# EAGLE design 20pin-adapter (EAGLE 7.4.0)
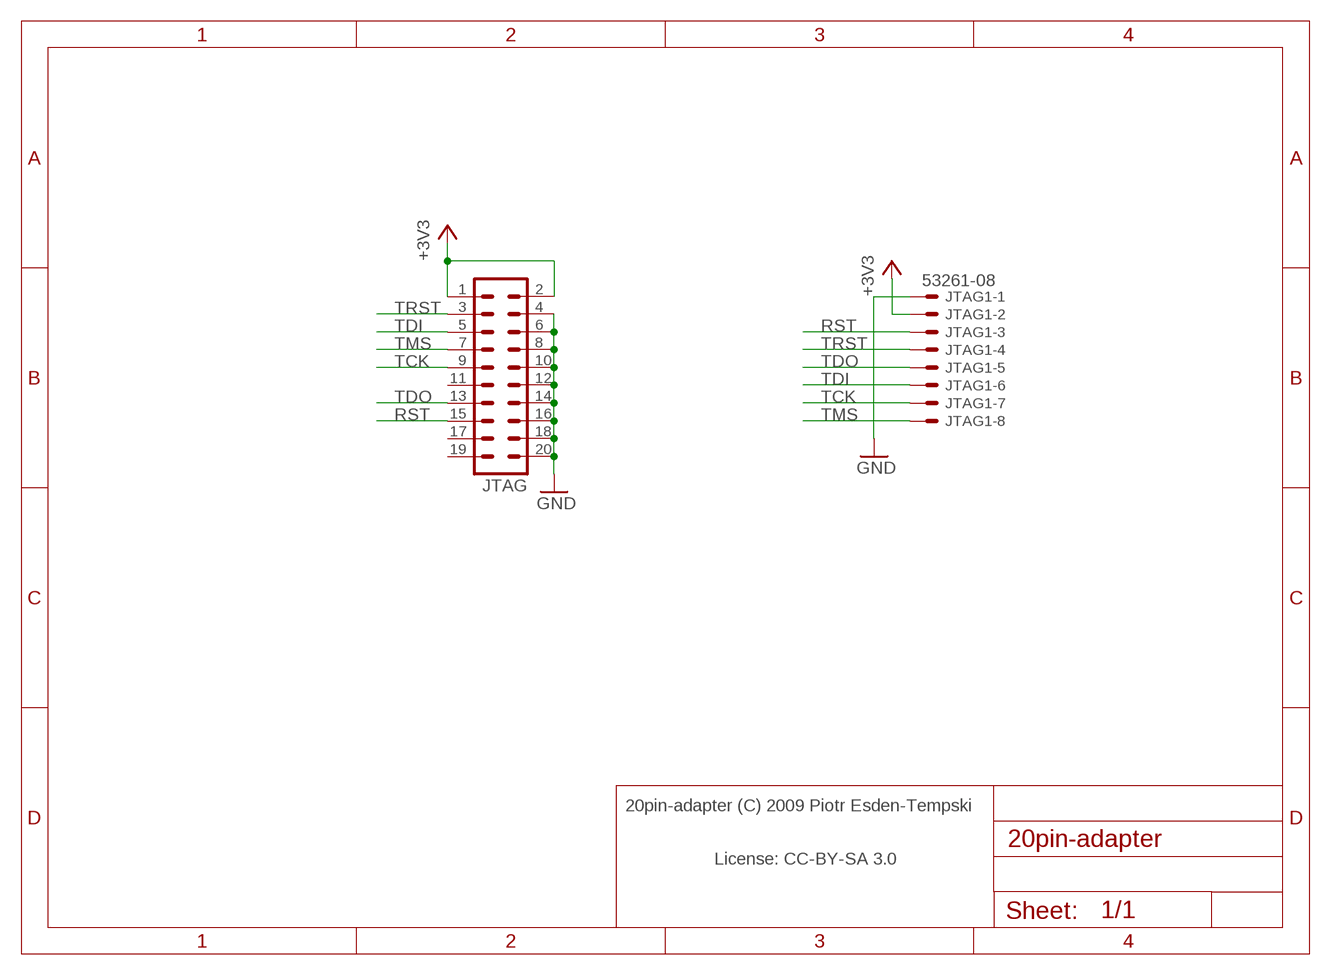
[diagram p0: schematic, sheet 1]

## Parts
JTAG  MA10-2  [MA10-2]
JTAG1  53261-08  [53261-08]

## Nets
+3V3: JTAG1.2 JTAG.1 JTAG.2
GND: JTAG1.1 JTAG.4 JTAG.6 JTAG.8 JTAG.10 JTAG.12 JTAG.14 JTAG.16 JTAG.18 JTAG.20
RST: JTAG1.3 JTAG.15
TCK: JTAG1.7 JTAG.9
TDI: JTAG1.6 JTAG.5
TDO: JTAG1.5 JTAG.13
TMS: JTAG1.8 JTAG.7
TRST: JTAG1.4 JTAG.3
Unconnected: JTAG.11 JTAG.17 JTAG.19

## Notes on the sheet
- 20pin-adapter (C) 2009 Piotr Esden-Tempski
- License: CC-BY-SA 3.0

## Library data of the parts
JTAG = con-lstb:MA10-2: PIN HEADER
JTAG1 = con-molex:53?-08: CONNECTOR wire to board 1.25 mm (.049 inch) pitch header

## Net classes
0 default: width 0.152 mm, drill 0.305 mm, clearance 0.152 mm

## Board
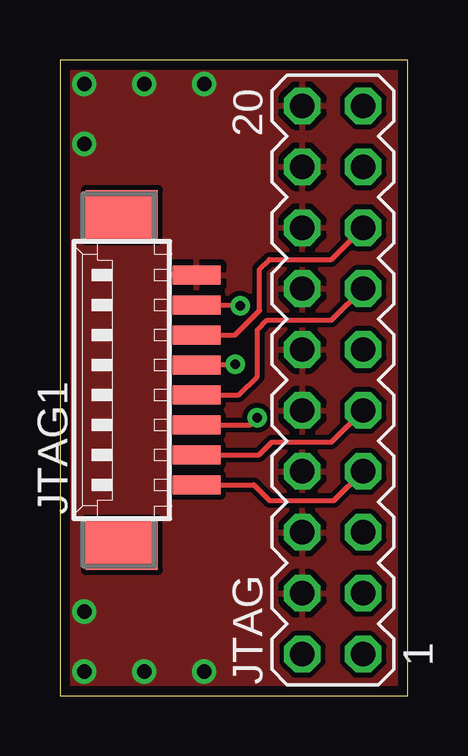
[diagram p1: board, top side]
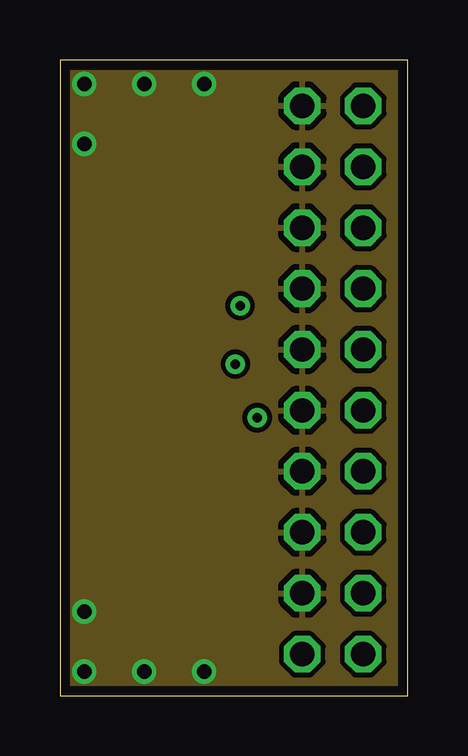
[diagram p2: board, inner layer Route2]
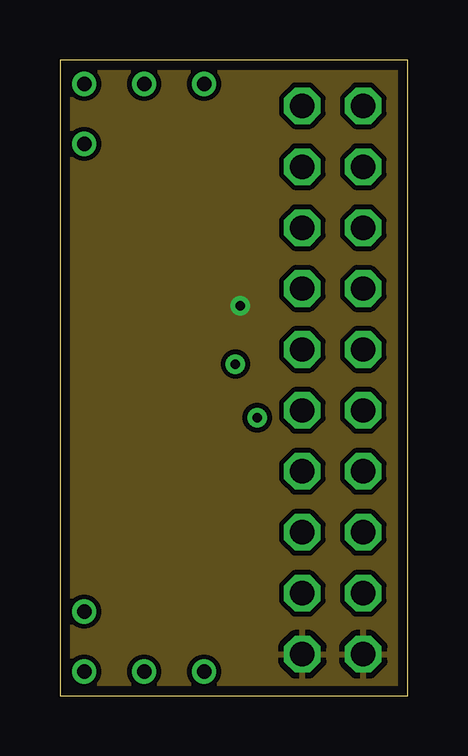
[diagram p3: board, inner layer Route15]
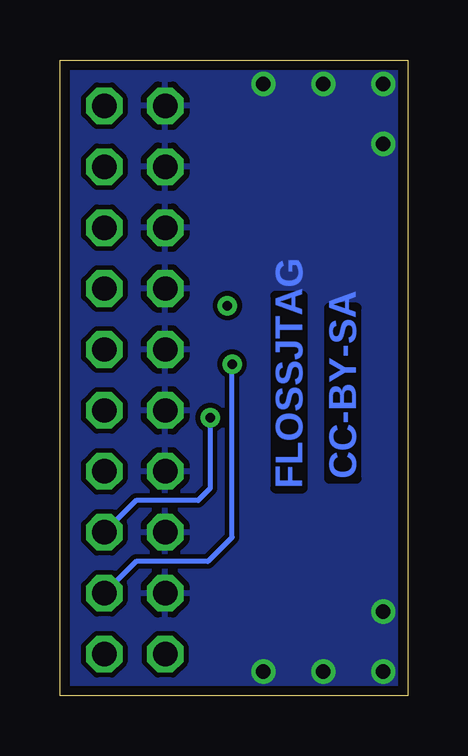
[diagram p4: board, bottom side, seen from below]

Size 14.5 x 26.5 mm. Coordinates in mm from the lower left corner, seen from the top.
Outline: 0,0 14.5,0 14.5,26.5 0,26.5 0,0
Copper layers (1*2+15*16): Top 0.035mm / dielectric 0.5mm / Route2 0.035mm / dielectric 0.15mm / Route15 0.035mm / dielectric 0.5mm / Bottom 0.035mm
Design rules "default *": minimum track width 7mil, minimum drill 0.4mm, track to track 8mil, track to pad 8mil, pad to pad 8mil, via to via 8mil, smd to smd 8mil, copper to edge 16mil, drill to drill 8mil, minimum pad ring 10mil, minimum via ring 8mil, stop-mask expansion 4mil, vias tented up to drill 0.4mm, thermal gap 10mil

### Footprints (pad centres in the part's own frame; a part is rotated, then mirrored left to right if it is on the bottom)
MA10-2 = drill 1.016 octagon: 1 -11.43,-1.27; 2 -11.43,1.27; 3 -8.89,-1.27; 4 -8.89,1.27; 5 -6.35,-1.27; 6 -6.35,1.27; 7 -3.81,-1.27; 8 -3.81,1.27; 9 -1.27,-1.27; 10 -1.27,1.27; 11 1.27,-1.27; 12 1.27,1.27; 13 3.81,-1.27; 14 3.81,1.27; 15 6.35,-1.27; 16 6.35,1.27; 17 8.89,-1.27; 18 8.89,1.27; 19 11.43,-1.27; 20 11.43,1.27
53261-08 = smd 0.8 x 2: 1 4.375,-2.5; 2 3.125,-2.5; 3 1.875,-2.5; 4 0.625,-2.5; 5 -0.625,-2.5; 6 -1.875,-2.5; 7 -3.125,-2.5; 8 -4.375,-2.5 | smd 2.1 x 3: S1 6.875,0.625; S2 -6.875,0.625

### Placement (x,y rotation side)
JTAG  11.38,13.16 90 top
JTAG1  3.2,13.16 90 top

### Tracks (layer width: path | path; a pad name or v marks a point on that pad's centre or on a via)
+3V3  (via drill 0.4)
  Top 0.203: JTAG1.2 7.52,16.28 v7.52,16.26
  pour Route15: 0,0 14.5,0 14.5,26.5 0,26.5
GND  (via drill 0.6)
  other vias: 1.02,25.5 3.52,25.5 6.02,25.5 1.02,23 1.02,1 1.02,3.5 3.52,1 6.02,1
  pour Bottom: 0,0 14.5,0 14.5,26.5 0,26.5
  pour Top: 0,0 14.5,0 14.5,26.5 0,26.5
  pour Route2: 0,0 14.5,0 14.5,26.5 0,26.5
RST
  Top 0.203: JTAG1.3 7.31,15.03 8.33,16.05 8.33,17.78 8.74,18.19 11.33,18.19 JTAG.15
TCK
  Top 0.203: JTAG1.7 8.3,10.03 8.84,10.57 11.33,10.57 JTAG.9
TDI  (via drill 0.4)
  Top 0.203: JTAG1.6 7.93,11.28 v8.23,11.58
  Bottom 0.203: v8.23,11.58 8.23,8.64 8.74,8.13 11.33,8.13 JTAG.5
TDO
  Top 0.203: JTAG1.5 7.45,12.53 8.23,13.31 8.23,15.24 8.64,15.65 11.33,15.65 JTAG.13
TMS
  Top 0.203: JTAG1.8 8.08,8.78 8.74,8.13 11.43,8.13 JTAG.7
TRST  (via drill 0.4)
  Top 0.203: JTAG1.4 7.28,13.78 v7.32,13.82
  Bottom 0.203: v7.32,13.82 7.32,6.6 8.33,5.59 11.33,5.59 JTAG.3

### Text on the board
Bottom: CC-BY-SA | FLOSSJTAG
bStop: CC-BY-SA | FLOSSJTAG